# Altium schematic sheet UWB_STM32F105.SchDoc
size A4
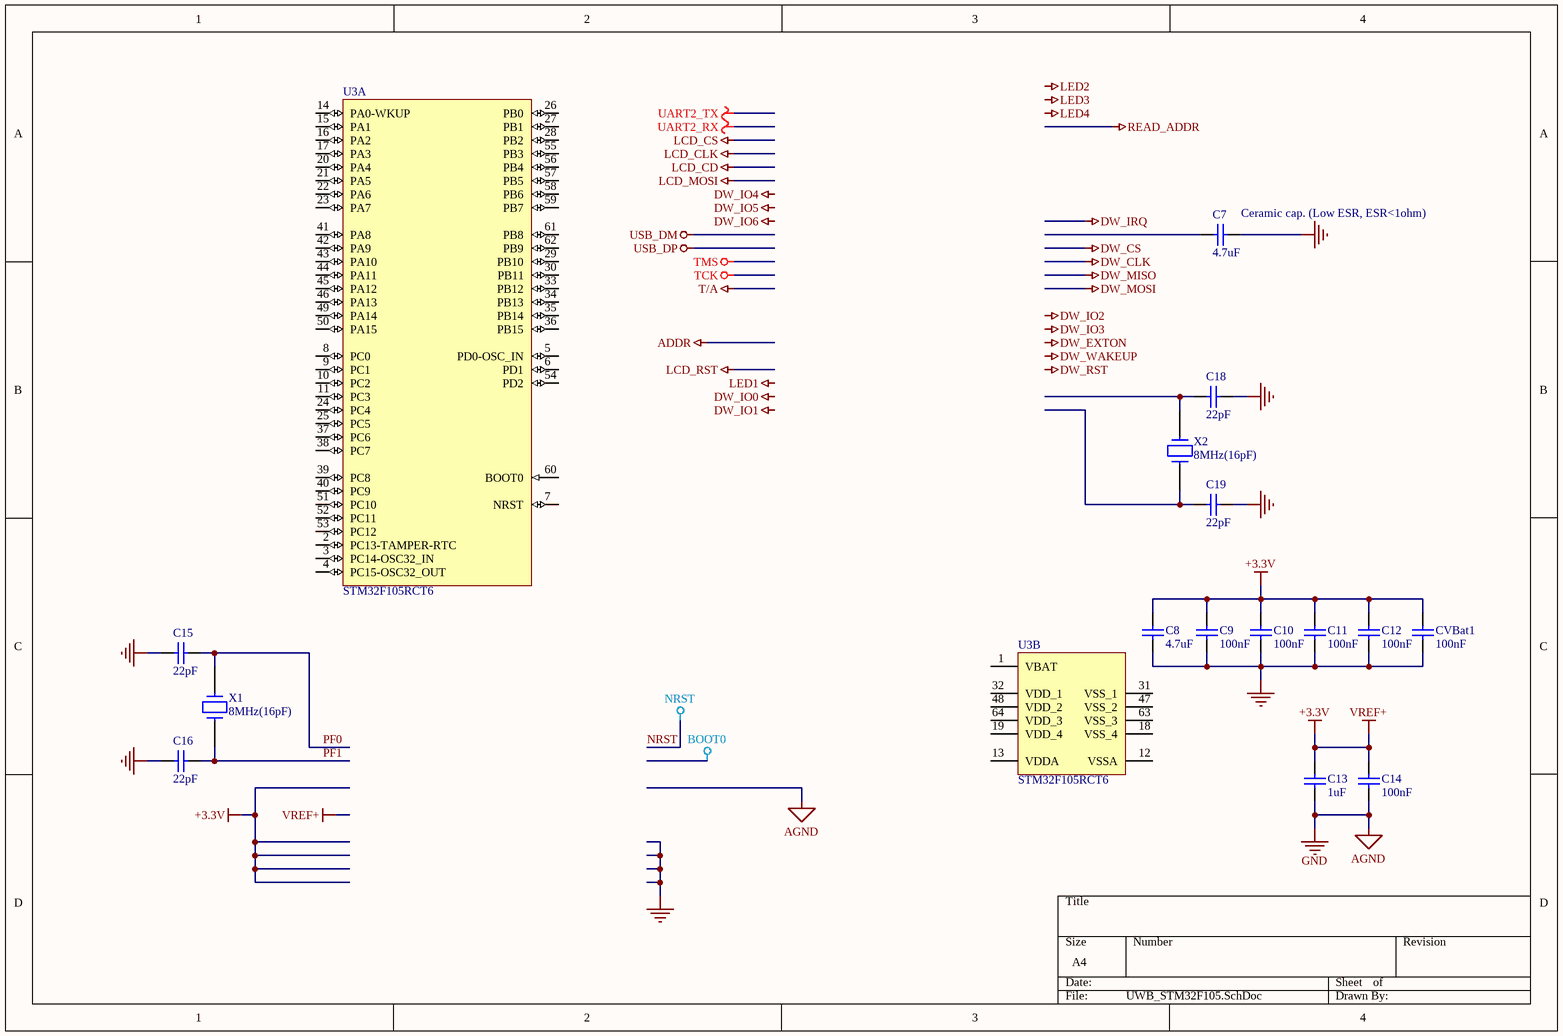
[diagram p0: UWB_STM32F105.SchDoc]

## Parts
C7  value 4.7uF  [CAPC2012L]  (hidden comment: Cap)
C8  value 4.7uF  [CAPC2012L]  (hidden comment: Cap)
C9  value 100nF  [CAPC1608L]  (hidden comment: Cap)
C10  value 100nF  [CAPC1608L]  (hidden comment: Cap)
C11  value 100nF  [CAPC1608L]  (hidden comment: Cap)
C12  value 100nF  [CAPC1608L]  (hidden comment: Cap)
C13  value 1uF  [CAPC1608L]  (hidden comment: Cap)
C14  value 100nF  [CAPC1608L]  (hidden comment: Cap)
C15  value 22pF  [CAPC1608L]  (hidden comment: Cap)
C16  value 22pF  [CAPC1608L]  (hidden comment: Cap)
C18  value 22pF  [CAPC1608L]  (hidden comment: Cap)
C19  value 22pF  [CAPC1608L]  (hidden comment: Cap)
CVBat1  value 100nF  [CAPC1608L]  (hidden comment: Cap)
U3  STM32F105RCT6  [LQFP64_N]  (parts A,B of 2)
X1  8MHz(16pF)  [XTAL ABM7]
X2  8MHz(16pF)  [XTAL ABS13]

## Nets
+3.3V: C8.2 C9.2 C10.2 C11.2 C12.2 C13.2 C14.2 CVBat1.2  [also labelled VREF+]
AGND: C7.1 C8.1 C9.1 C10.1 C11.1 C12.1 C13.1 C14.1 C15.2 C16.2 C18.2 C19.2 CVBat1.1  [also labelled GND]
PF0: C15.1 X1.2
PF1: C16.1 X1.1
NetC18_1: C18.1 X2.1
NetC19_1: C19.1 X2.2

Not connected (* = marked no-connect by the designer): C7 2; U3 1(VBAT) 2(PC13-TAMPER-RTC) 3(PC14-OSC32_IN) 4(PC15-OSC32_OUT) 5(PD0-OSC_IN) 6(PD1) 7(NRST) 8(PC0) 9(PC1) 10(PC2) 11(PC3) 12(VSSA) 13(VDDA) 14(PA0-WKUP) 15(PA1) 16(PA2) 17(PA3) 18(VSS_4) 19(VDD_4) 20(PA4) 21(PA5) 22(PA6) 23(PA7) 24(PC4) 25(PC5) 26(PB0) 27(PB1) 28(PB2) 29(PB10) 30(PB11) 31(VSS_1) 32(VDD_1) 33(PB12) 34(PB13) 35(PB14) 36(PB15) 37(PC6) 38(PC7) 39(PC8) 40(PC9) 41(PA8) 42(PA9) 43(PA10) 44(PA11) 45(PA12) 46(PA13) 47(VSS_2) 48(VDD_2) 49(PA14) 50(PA15) 51(PC10) 52(PC11) 53(PC12) 54(PD2) 55(PB3) 56(PB4) 57(PB5) 58(PB6) 59(PB7) 60(BOOT0) 61(PB8) 62(PB9) 63(VSS_3) 64(VDD_3)

## Notes on the sheet
- (near C7) Ceramic cap. (Low ESR, ESR<1ohm)
- Labels drawn without touching a wire or pin: DW_EXTON, DW_IO0, DW_IO1, DW_IO2, DW_IO3, DW_IO4, DW_IO5, DW_IO6, DW_RST, DW_WAKEUP, GND, LED1, LED2, LED3, LED4

## Library data of the parts
C7 C8 = Cap: Capacitor; Proveedor: Future Electronics; PN: CC0805KRX5R6BB475; Proveedor 2: Elemon; PN 2: CA3279960; Published: 8-Jun-2000; LatestRevisionDate: 17-Jul-2002; LatestRevisionNote: Re-released for DXP Platform.; PackageReference: RAD-0.3; Publisher: Altium Limited; PackageDescription: Radial Cap, Thru-Hole; 2 Leads; 0.3 in Pin Spacing
C9-C12 C14 CVBat1 = Cap: Capacitor; Proveedor: Future Electronics; PN: CC0603KRX7R6BB104; Proveedor 2: Elemon; PN 2: CA3289100; Published: 8-Jun-2000; LatestRevisionDate: 17-Jul-2002; LatestRevisionNote: Re-released for DXP Platform.; PackageReference: RAD-0.3; Publisher: Altium Limited; PackageDescription: Radial Cap, Thru-Hole; 2 Leads; 0.3 in Pin Spacing
C13 = Cap: Capacitor; Proveedor: Future Electronics; PN: CC0603KRX5R5BB105; Proveedor 2: Elemon; PN 2: CA3289821; Published: 8-Jun-2000; LatestRevisionDate: 17-Jul-2002; LatestRevisionNote: Re-released for DXP Platform.; PackageReference: RAD-0.3; Publisher: Altium Limited; PackageDescription: Radial Cap, Thru-Hole; 2 Leads; 0.3 in Pin Spacing
C15 C16 C18 C19 = Cap: Capacitor; Proveedor: Future Electronics; PN: 0603YA220KAT2A; Proveedor 2: Elemon; PN 2: CA3288483; Published: 8-Jun-2000; LatestRevisionDate: 17-Jul-2002; LatestRevisionNote: Re-released for DXP Platform.; PackageReference: RAD-0.3; Publisher: Altium Limited; PackageDescription: Radial Cap, Thru-Hole; 2 Leads; 0.3 in Pin Spacing
U3 = STM32F105RCT6: STM32 ARM-based 32-bit MCU Connectivity Line with 256 kB Flash, 64 kB Internal RAM, -40 to +85°C Temperature, 64-Pin LQFP, Tray; DatasheetVersion: rev5.0, May-2010; PackageVersion: rev13, Apr-2011; PackageReference: LQFP64; PackageDescription: 64-Pin Low-Profile Quad Flat Pack, 10 x 10 mm Body, 0.5 mm Pitch (LQFP64); ComponentLink1Description: Manufacturer URL; ComponentLink1URL: http://www.st.com/; ComponentLink2Description: STM32F105/107 Datasheet; ComponentLink2URL: http://www.st.com/internet/com/TECHNICAL_RESOURCES/TECHNICAL_LITERATURE/DATASHEET/CD00220364.pdf; ComponentLink3Description: STM32 Family Web Page; ComponentLink3URL: www.st.com/stm32
X1 X2 = CRYSTAL: PN: ABM7-8.000MHZ-D2Y-T; Proveedor: Future Electronics; PN 2: X1; Value: 8MHz(16pF)